# EasyEDA Pro project ProPrj_两相交错电源demo_2025-05-26.epro, schematic lm5143_1
Board Name: 5143一体板; Create Date: 2025-05-03; Page Name: P1; Project Name: 两相交错电源demo; Schematic Name: lm5143_1; Update Date: 2025-05-10; Company: 嘉立创EDA; Page Size: A4; Version: V1.0
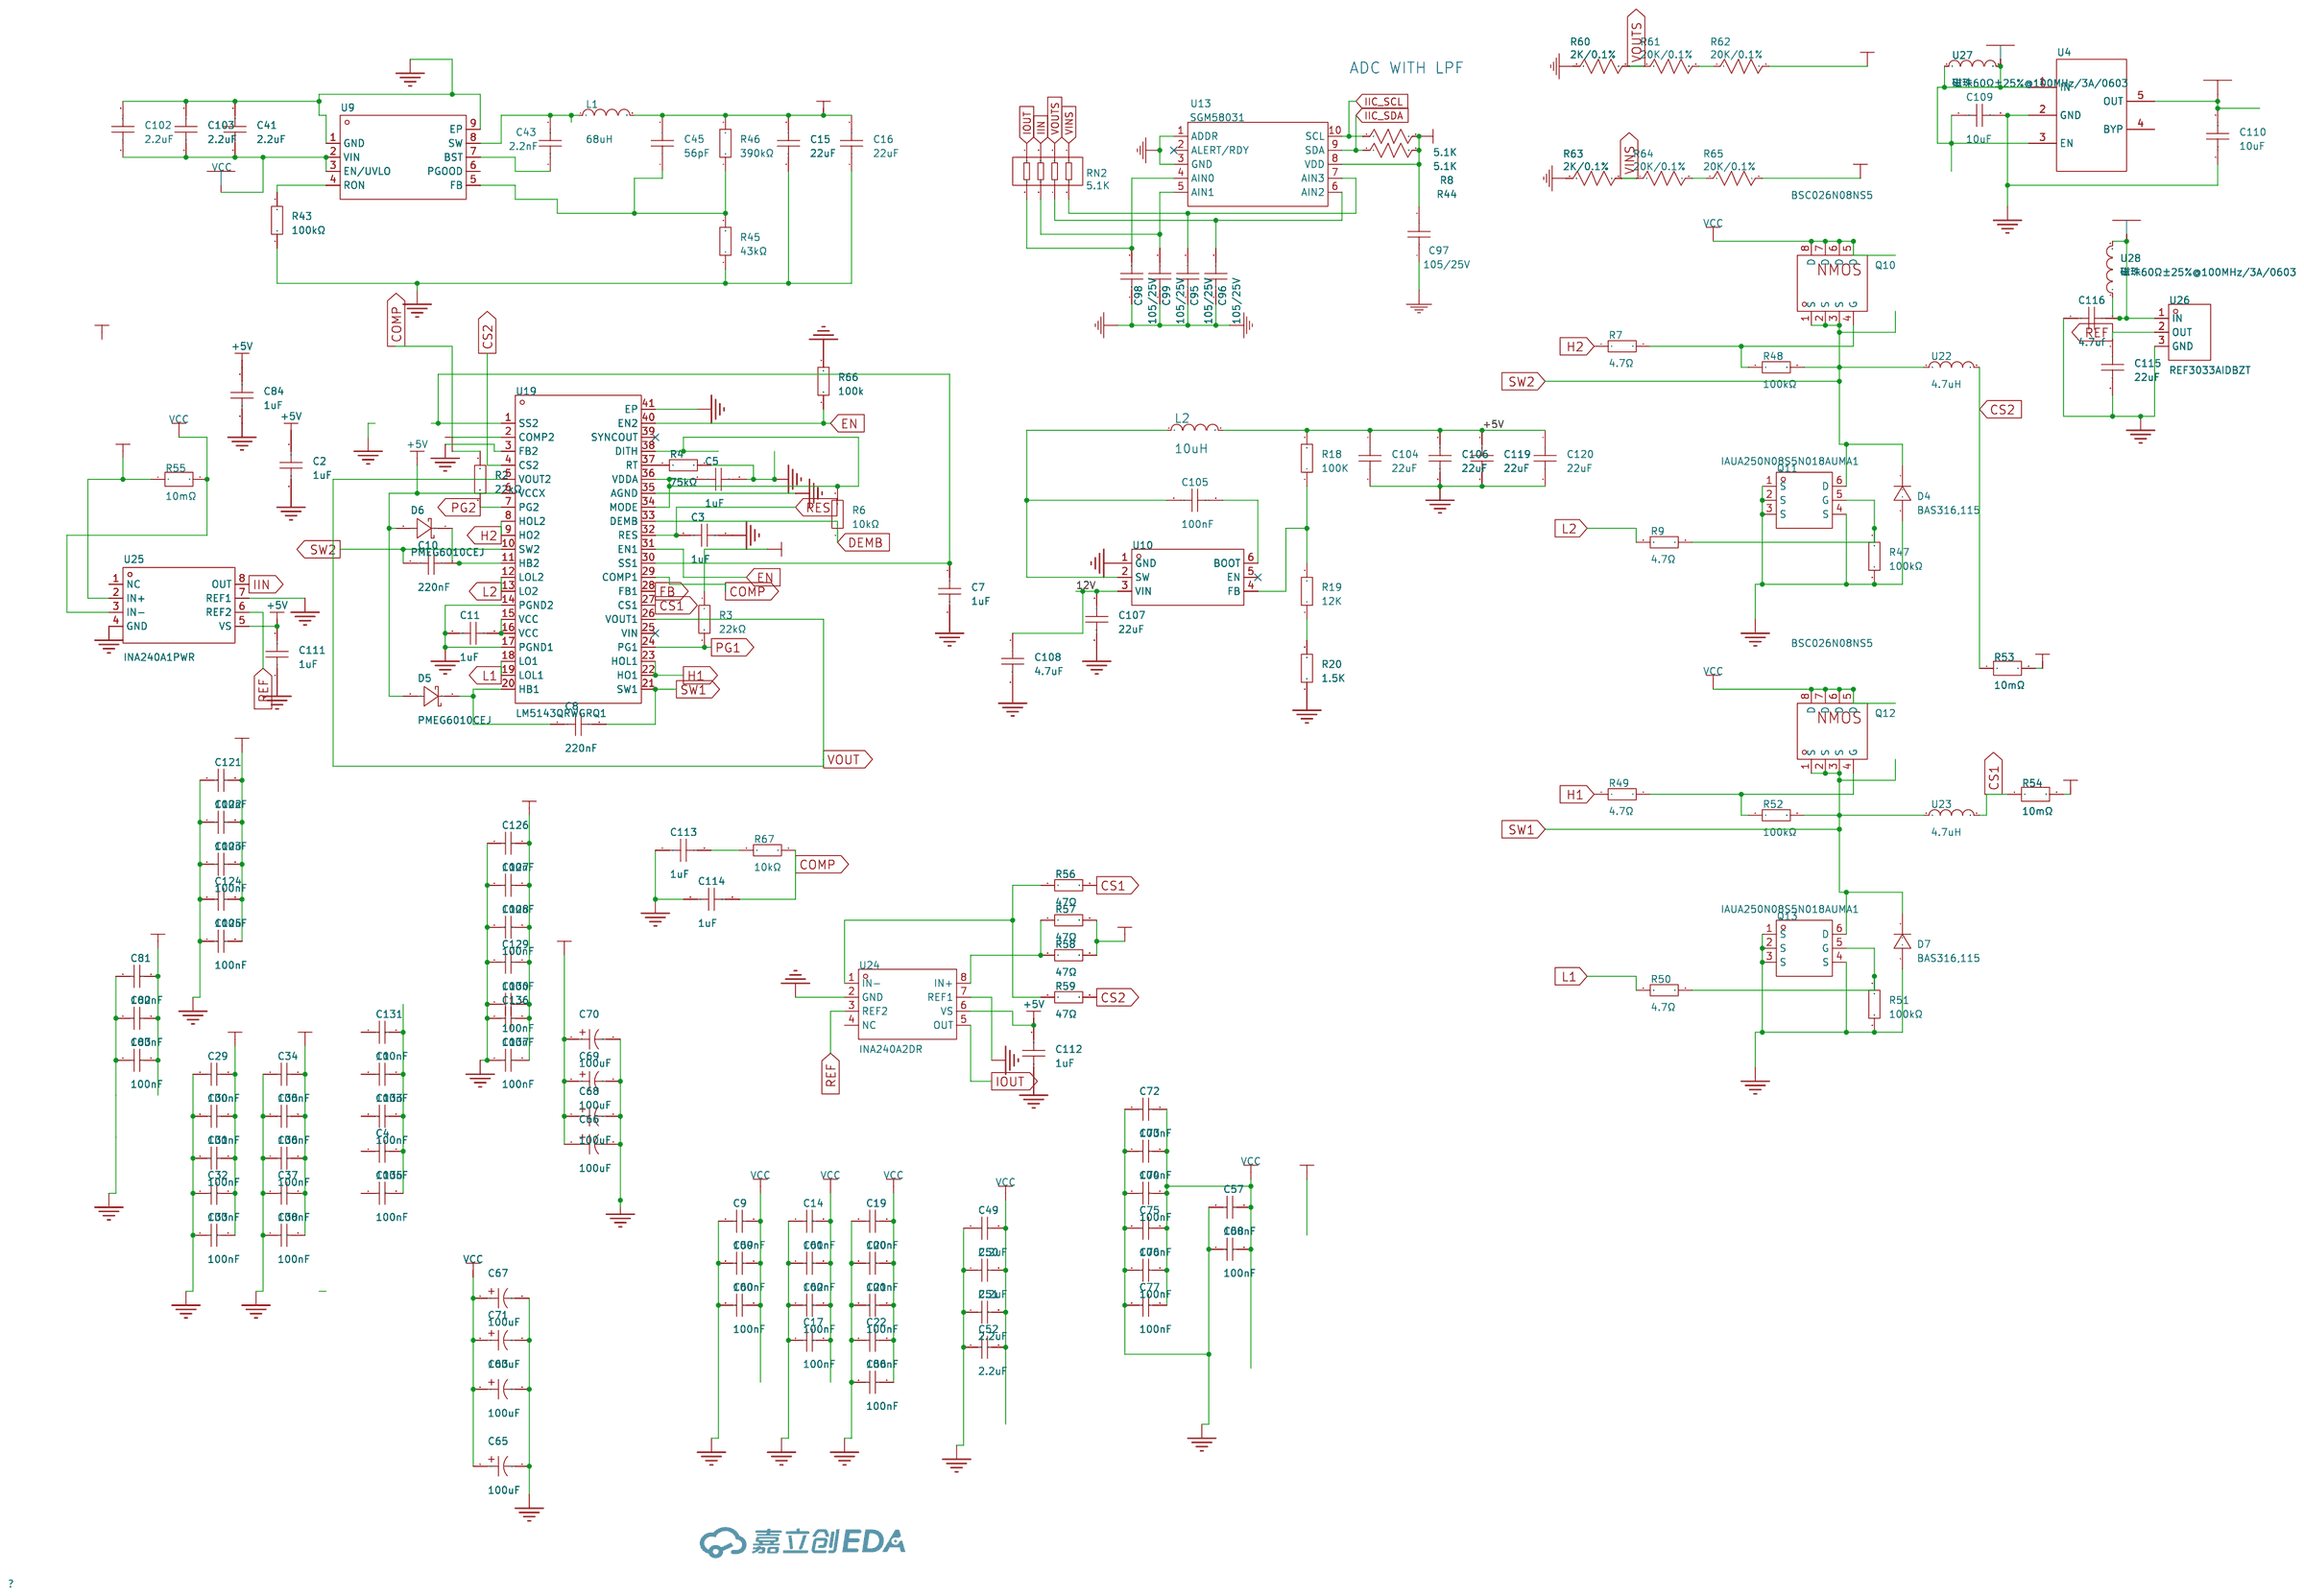
[diagram p1: schematic sheet]

## Parts
C1  100nF  [C1210]
C2  1uF  [C0603]
C3  1uF  [C0603]
C4  100nF  [C1210]
C5  1uF  [C0603]
C7  1uF  [C0603]
C8  220nF  [C0402]
C9  100nF  [C1210]
C10  220nF  [C0402]
C11  1uF  [C0603]
C14  100nF  [C1210]
C15  22uF  [C0805]
C16  22uF  [C0805]
C17  100nF  [C1206]
C19  100nF  [C1210]
C20  100nF  [C1210]
C21  100nF  [C1210]
C22  100nF  [C1210]
C29  100nF  [C1210]
C30  100nF  [C1210]
C31  100nF  [C1210]
C32  100nF  [C1210]
C33  100nF  [C1210]
C34  100nF  [C1210]
C35  100nF  [C1210]
C36  100nF  [C1210]
C37  100nF  [C1210]
C38  100nF  [C1210]
C41  2.2uF  [C0805]
C43  2.2nF  [C0603]
C45  56pF  [C0603]
C49  2.2uF  [C0805]
C50  2.2uF  [C0805]
C51  2.2uF  [C0805]
C52  2.2uF  [C0805]
C56  100nF  [C1210]
C57  100nF  [C1210]
C58  100nF  [C1210]
C59  100nF  [C1210]
C60  100nF  [C1210]
C61  100nF  [C1210]
C62  100nF  [C1206]
C63  100uF  [CAP-TH_BD10.0-P5.00-D0.6-FD_2]
C65  100uF  [CAP-TH_BD10.0-P5.00-D0.6-FD_2]
C66  100uF  [CAP-TH_BD10.0-P5.00-D0.6-FD_2]
C67  100uF  [CAP-TH_BD10.0-P5.00-D0.6-FD_2]
C68  100uF  [CAP-TH_BD10.0-P5.00-D0.6-FD_2]
C69  100uF  [CAP-TH_BD10.0-P5.00-D0.6-FD_2]
C70  100uF  [CAP-TH_BD10.0-P5.00-D0.6-FD_2]
C71  100uF  [CAP-TH_BD10.0-P5.00-D0.6-FD_2]
C72  100nF  [C1210]
C73  100nF  [C1210]
C74  100nF  [C1210]
C75  100nF  [C1210]
C76  100nF  [C1210]
C77  100nF  [C1210]
C81  100nF  [C1210]
C82  100nF  [C1210]
C83  100nF  [C1210]
C84  1uF  [C0603]
C95  105/25V  [C0603]
C96  105/25V  [C0603]
C97  105/25V  [C0603]
C98  105/25V  [C0603]
C99  105/25V  [C0603]
C102  2.2uF  [C0805]
C103  2.2uF  [C0805]
C104  22uF  [C0603]
C105  100nF  [C0603]
C106  22uF  [C0603]
C107  22uF  [C0805]
C108  4.7uF  [C0603]
C109  10uF  [C0603]
C110  10uF  [C0603]
C111  1uF  [C0603]
C112  1uF  [C0603]
C113  1uF  [C0603]
C114  1uF  [C0603]
C115  22uF  [C0603]
C116  4.7uf  [C0603]
C119  22uF  [C0603]
C120  22uF  [C0603]
C121  100nF  [C1210]
C122  100nF  [C1210]
C123  100nF  [C1210]
C124  100nF  [C1210]
C125  100nF  [C1210]
C126  100nF  [C1210]
C127  100nF  [C1210]
C128  100nF  [C1210]
C129  100nF  [C1210]
C130  100nF  [C1210]
C131  100nF  [C1210]
C133  100nF  [C1210]
C135  100nF  [C1210]
C136  100nF  [C1210]
C137  100nF  [C1210]
D4  BAS316,115  [SOD-323_L1.8-W1.3-LS2.5-FD]
D5  PMEG6010CEJ  [SOD-323_L1.7-W1.3-LS2.5-RD-1]
D6  PMEG6010CEJ  [SOD-323_L1.7-W1.3-LS2.5-RD-1]
D7  BAS316,115  [SOD-323_L1.8-W1.3-LS2.5-FD]
L1  68uH  [IND-SMD_L7.1-W6.6-1]
L2  10uH  [IND-SMD_L5.4-W5.2_FXL0530]
Q10  BSC026N08NS5  [PG-TDSON-8_L5.0-W6.0-P1.27-BL-EP]
Q11  IAUA250N08S5N018AUMA1  [PG-HSOF-5_L6.9-W6.7-P1.30-LS8.0-BL]
Q12  BSC026N08NS5  [PG-TDSON-8_L5.0-W6.0-P1.27-BL-EP]
Q13  IAUA250N08S5N018AUMA1  [PG-HSOF-5_L6.9-W6.7-P1.30-LS8.0-BL]
R2  22kΩ  [R0603]
R3  22kΩ  [R0603]
R4  75kΩ  [R0603]
R6  10kΩ  [R0603]
R7  4.7Ω  [R0603]
R8  5.1K  [R0603]
R9  4.7Ω  [R0603]
R18  100K  [R0603]
R19  12K  [R0603]
R20  1.5K  [R0603]
R43  100kΩ  [R0603]
R44  5.1K  [R0603]
R45  43kΩ  [R0603]
R46  390kΩ  [R0603]
R47  100kΩ  [R0603]
R48  100kΩ  [R0603]
R49  4.7Ω  [R0603]
R50  4.7Ω  [R0603]
R51  100kΩ  [R0603]
R52  100kΩ  [R0603]
R53  10mΩ  [RES-SMD_L6.4-W3.2-R2512]
R54  10mΩ  [RES-SMD_L6.4-W3.2-R2512]
R55  10mΩ  [RES-SMD_L6.4-W3.2-R2512]
R56  47Ω  [R0603]
R57  47Ω  [R0603]
R58  47Ω  [R0603]
R59  47Ω  [R0603]
R60  2K/0.1%  [R0603]
R61  20K/0.1%  [R0603]
R62  20K/0.1%  [R0603]
R63  2K/0.1%  [R0603]
R64  20K/0.1%  [R0603]
R65  20K/0.1%  [R0603]
R66  100k  [R0603]
R67  10kΩ  [R0603]
RN2  5.1K  [RES-ARRAY-SMD_0603-8P-L3.2-W1.6-BL]
U4  -  [SOT-23-5_L3.0-W1.7-P0.95-LS2.8-TL]
U9  -  [SO-8_L4.9-W3.9-P1.27-LS6.0-BL-EP]
U10  TPS54302DDCR  [SOT-23-6_L2.9-W1.6-P0.95-LS2.8-BL]
U13  SGM58031  [MSOP-10_L3.0-W3.0-P0.50-LS5.0-BR]
U19  LM5143QRWGRQ1  [VQFN-40_L6.0-W6.0-P0.50-TL-EP3.3]
U22  4.7uH  [IND-SMD_L23.5-W22.0]
U23  4.7uH  [IND-SMD_L23.5-W22.0]
U24  INA240A2DR  [SOIC-8_L4.9-W3.9-P1.27-LS6.0-BL]
U25  INA240A1PWR  [TSSOP-8_L4.4-W3.0-P0.65-LS6.4-BL]
U26  REF3033AIDBZT  [SOT-23-3_L2.9-W1.3-P1.90-LS2.4-BR]
U27  磁珠60Ω±25%@100MHz/3A/0603  [L0603]
U28  磁珠60Ω±25%@100MHz/3A/0603  [L0603]

## Library data of the parts
C1 C4 C9 C14 C17 C19-C22 C29-C38 C56-C62 C72-C77 C81-C83 C121-C131 C133 C135-C137 = CL31B104KBCNNNC: 容值:100nF;精度:±10%;额定电压:50V;材质(温度系数):X7R;; LCSC Part Name: 100nF ±10% 50V; Supplier Part: C24497; Manufacturer: SAMSUNG(三星); Supplier Footprint: 1206; JLCPCB Part Class: 基础库; Datasheet: https://atta.szlcsc.com/upload/public/pdf/source/20160218/1457707763339.pdf; Supplier: LCSC; Tolerance: ±10%; Voltage Rated: 50V; Temperature Coefficient: X7R
C2 C3 C5 C7 C11 C84 C111-C114 = CL10A105KB8NNNC: 容值:1uF;精度:±10%;额定电压:50V;材质(温度系数):X5R;; LCSC Part Name: 1uF ±10% 50V; Supplier Part: C15849; Manufacturer: SAMSUNG(三星); Supplier Footprint: 0603; JLCPCB Part Class: 基础库; Datasheet: https://atta.szlcsc.com/upload/public/pdf/source/20160218/1457707763339.pdf; Supplier: LCSC; Tolerance: ±10%; Voltage Rated: 50V; Temperature Coefficient: X5R
C8 C10 = CL10B224KA8NNNC: 容值:220nF;精度:±10%;额定电压:25V;材质(温度系数):X7R;; LCSC Part Name: 220nF ±10% 25V; Supplier Part: C21120; Manufacturer: SAMSUNG(三星); Supplier Footprint: 0603; JLCPCB Part Class: Basic Part; Datasheet: https://atta.szlcsc.com/upload/public/pdf/source/20160218/1457707763339.pdf; Supplier: LCSC; Tolerance: ±10%; Voltage Rated: 25V; Temperature Coefficient: X7R
C15 C16 = CL21A226MAQNNNE_C45783: 容值:22uF;精度:±20%;额定电压:25V;材质(温度系数):X5R;; LCSC Part Name: 22uF ±20% 25V; Supplier Part: C45783; Manufacturer: SAMSUNG(三星); Manufacturer Part: CL21A226MAQNNNE; Supplier Footprint: 0805; JLCPCB Part Class: 基础库; Datasheet: https://atta.szlcsc.com/upload/public/pdf/source/20160103/1457707727161.pdf; Supplier: LCSC; Tolerance: ±20%; Voltage Rated: 25V; Temperature Coefficient: X5R
C41 C102 C103 = HHV0805R7225K101NSLJ: 容值:2.2uF;精度:±10%;额定电压:100V;材质(温度系数):X7R;; LCSC Part Name: 2.2uF ±10% 100V; Supplier Part: C22367838; Manufacturer: Chinocera(华瓷); Supplier Footprint: 0805; JLCPCB Part Class: Extended Part; Datasheet: https://atta.szlcsc.com/upload/public/pdf/source/20240326/047A46E16B3E574E3E72A3B6624FA886.pdf; Supplier: LCSC; Tolerance: ±10%; Voltage Rated: 100V; Temperature Coefficient: X7R
C43 = C0603X5R106M160NT: 容值:10uF;精度:±20%;额定电压:16V;温度系数:X5R;; LCSC Part Name: 10uF ±20% 16V; Supplier Part: C466781; Manufacturer: SANYEAR(叁叶源); Supplier Footprint: 0603; Datasheet: https://atta.szlcsc.com/upload/public/pdf/source/20191209/C466781_7B1C97983691E173DFF63AE7A9C35A8A.pdf; Supplier: LCSC; Tolerance: ±20%; Voltage Rated: 16V; Temperature Coefficient: X5R
C45 = 0603N560J500CT: 容值:56pF;精度:±5%;额定电压:50V;材质(温度系数):NP0;; LCSC Part Name: 56pF ±5% 50V; Supplier Part: C302071; Manufacturer: Walsin(华新科); Supplier Footprint: 0603; JLCPCB Part Class: Extended Part; Datasheet: https://atta.szlcsc.com/upload/public/pdf/source/20191217/C469650_84AD5C6F618CF4AC0C6D987F2E8FE6F8.pdf; Supplier: LCSC; Tolerance: ±5%; Voltage Rated: 50V; Temperature Coefficient: NP0
C49-C52 = CGA0805X7R225K101MT: 容值:2.2uF;精度:±10%;额定电压:100V;材质(温度系数):X7R;; LCSC Part Name: 2.2uF ±10% 100V; Supplier Part: C6119935; Manufacturer: HRE(芯声); Supplier Footprint: 0805; JLCPCB Part Class: Extended Part; Datasheet: https://atta.szlcsc.com/upload/public/pdf/source/20240429/FFBBB2C1A6FCA7F2201C7203CC19BC42.pdf; Supplier: LCSC; Tolerance: ±10%; Voltage Rated: 100V; Temperature Coefficient: X7R
C63 C65-C71 = 1011001013R00: 容值:100uF;精度:±20%;额定电压:100V;; LCSC Part Name: 100uF ±20% 100V; Supplier Part: C2887236; Manufacturer: NJCON(永立); Supplier Footprint: 插件,D10xL12mm; JLCPCB Part Class: 扩展库; Datasheet: https://atta.szlcsc.com/upload/public/pdf/source/20210902/84CE7E45D44660992A8A41ADB32108B0.pdf; Supplier: LCSC; Tolerance: ±20%; Rated Voltage: 100V; φD: 10mm; L: 13mm; Operating Temperature: -55℃~+105℃
C95-C99 = 105/25V: Supplier: LCSC
C104 C106 C115 C116 C119 C120 = CL10A226MQ8NRNC: 容值:22uF;精度:±20%;额定电压:6.3V;材质(温度系数):X5R;; LCSC Part Name: 22uF ±20% 6.3V; Supplier Part: C59461; Manufacturer: SAMSUNG(三星); Supplier Footprint: 0603; JLCPCB Part Class: 基础库; Datasheet: https://atta.szlcsc.com/upload/public/pdf/source/20160103/1457707740762.pdf; Supplier: LCSC; Tolerance: ±20%; Voltage Rated: 6.3V; Temperature Coefficient: X5R
C105 = CAP_0402: Supplier Footprint: 0402
C107 = CL21A226MOQNNNE: 容值:22uF;精度:±20%;额定电压:16V;材质(温度系数):X5R;; LCSC Part Name: 22uF ±20% 16V; Supplier Part: C98190; Manufacturer: SAMSUNG(三星); Supplier Footprint: 0805; JLCPCB Part Class: Extended Part; Datasheet: https://atta.szlcsc.com/upload/public/pdf/source/20160218/1457707763339.pdf; Supplier: LCSC; Tolerance: ±20%; Voltage Rated: 16V; Temperature Coefficient: X5R
C108 = CGA0603X5R475K160JT: 容值:4.7uF;精度:±10%;额定电压:16V;材质(温度系数):X5R;; LCSC Part Name: 4.7uF ±10% 16V; Supplier Part: C6119855; Manufacturer: HRE(芯声); Supplier Footprint: 0603; JLCPCB Part Class: Extended Part; Supplier: LCSC; Tolerance: ±10%; Voltage Rated: 16V; Temperature Coefficient: X5R
C109 C110 = C0805S102K1RAC7800: 容值:1nF;精度:±10%;额定电压:100V;温度系数:X7R;; LCSC Part Name: 1nF ±10% 100V; Supplier Part: C141167; Manufacturer: KEMET(基美); Supplier Footprint: 0805; Datasheet: https://atta.szlcsc.com/upload/public/pdf/source/20171201/C141167_15121177000921156234.pdf; Supplier: LCSC; Tolerance: ±10%; Voltage Rated: 100V; Temperature Coefficient: X7R
D4 D7 = BAS316,115_C109218: 二极管配置:2个独立式;功率:400mW;直流反向耐压(Vr):100V;平均整流电流(Io):250mA;正向压降(Vf):1.25V@150mA;反向电流(Ir):500nA@80V;反向恢复时间(trr):4ns;工作温度:+150℃@(Tj);; LCSC Part Name: 100V 250mA 4ns; Supplier Part: C109218; Manufacturer: Nexperia(安世); Supplier Footprint: SOD-323; JLCPCB Part Class: Extended Part; Datasheet: https://atta.szlcsc.com/upload/public/pdf/source/20180720/C109218_B61203C01302E59E123412E2611A2044.pdf; Supplier: LCSC; Diode Configuration: 2个独立式; Power Dissipation: 400mW; Reverse Voltage (Vr): 100V; Average Rectified Current (Io): 250mA; Forward Voltage (Vf@If): 1.25V@150mA; Reverse Leakage Current: 500nA@80V; Reverse Recovery Time (trr): 4ns; Operating Temperature: +150℃@(Tj)
D5 D6 = PMEG6010CEJ: Supplier Part: C27636122; Manufacturer: DOWO(东沃); Supplier Footprint: SOD-323; JLCPCB Part Class: 扩展库; Datasheet: https://atta.szlcsc.com/upload/public/pdf/source/20240708/59BFFF43CC407FDF9ABD688CB819A6EB.pdf; Supplier: LCSC
L1 = PSPMAA0605H-680M-IGF: 电感值:68uH;精度:±20%;额定电流:2A;饱和电流(Isat):2.5A;; LCSC Part Name: 68uH ±20% 2.5A; Supplier Part: C2983094; Manufacturer: PROD(谱罗德); Supplier Footprint: SMD,6.6x7.1mm; JLCPCB Part Class: 扩展库; Datasheet: https://atta.szlcsc.com/upload/public/pdf/source/20220421/FA7B36985F5EDDBED7850D2E38F6BF27.pdf; Supplier: LCSC; Tolerance: ±20%; Rated Current: 2A; Saturation Current (Isat): 2.5A; DC Resistance (DCR): 256mΩ; Ratings: AEC-Q200
L2 = FXL0530-100-M: 电感值:10uH;精度:±20%;额定电流:3.2A;饱和电流(Isat):3.5A;; LCSC Part Name: 10uH ±20% 3.2A 110mΩ; Supplier Part: C177248; Manufacturer: cjiang(长江微电); Supplier Footprint: SMD,5.4x5.2x2.8mm; JLCPCB Part Class: 扩展库; Supplier: LCSC; Tolerance: ±20%; Rated Current: 3.2A; Saturation Current (Isat): 3.5A; DC Resistance (DCR): 110mΩ
Q10 Q12 = BSC026N08NS5: 类型:-;漏源电压(Vdss):-;连续漏极电流(Id):-;功率(Pd):-;导通电阻(RDS(on)@Vgs,Id):-;阈值电压(Vgs(th)@Id):-;; Supplier Part: C534311; Manufacturer: Infineon(英飞凌); Supplier Footprint: TDSON-8-EP(5x6); JLCPCB Part Class: 扩展库; Datasheet: https://atta.szlcsc.com/upload/public/pdf/source/20210128/C534311_A26F5C2A3F6ED0B8CFCE9EC3167D41E6.pdf; Supplier: LCSC
Q11 Q13 = IAUA250N08S5N018AUMA1: 类型:1个N沟道;漏源电压(Vdss):80V;连续漏极电流(Id):250A;导通电阻(RDS(on)@Vgs,Id):1.8mΩ@10V,100A;功率(Pd):238W;阈值电压(Vgs(th)@Id):3V@150uA;; LCSC Part Name: 1个N沟道 耐压:80V 电流:250A; Supplier Part: C3278535; Manufacturer: Infineon(英飞凌); Supplier Footprint: HSOF-5; JLCPCB Part Class: 扩展库; Datasheet: https://atta.szlcsc.com/upload/public/pdf/source/20240403/39AEE34ACE6EFA979F114E79687E3BC9.pdf; Supplier: LCSC; Type: 1个N沟道; Drain Source Voltage (Vdss): 80V; Continuous Drain Current (Id): 250A; Drain Source On Resistance (RDS(on)@Vgs,Id): 1.8mΩ@10V,100A; Power Dissipation (Pd): 238W; Gate Threshold Voltage (Vgs(th)@Id): 3V@150uA; Total Gate Charge (Qg@Vgs): 125nC@10V; Input Capacitance (Ciss@Vds): 8.715nF@40V; Reverse Transfer Capacitance (Crss@Vds): 70pF@40V; Operating Temperature: -55℃~+175℃
R2-R4 R6 R47 R48 R51 R52 R66 R67 = 0603WAF7502T5E: 电阻类型:厚膜电阻;阻值:75kΩ;精度:±1%;功率:100mW;最大工作电压:75V;温度系数:±100ppm/℃;; LCSC Part Name: 75kΩ ±1% 100mW 厚膜电阻; Supplier Part: C23242; Manufacturer: UNI-ROYAL(厚声); Supplier Footprint: 0603; JLCPCB Part Class: 基础库; Datasheet: https://atta.szlcsc.com/upload/public/pdf/source/20200306/C422600_1E6D84923E4A46A82E41ADD87F860B5C.pdf; Supplier: LCSC; Type: 厚膜电阻; Tolerance: ±1%; Power(Watts): 100mW; Overload Voltage (Max): 75V; Temperature Coefficient: ±100ppm/℃; Operating Temperature Range: -55℃~+155℃
R7 R9 R49 R50 = 0805W8F470KT5E: 电阻类型:厚膜电阻;阻值:4.7Ω;精度:±1%;功率:125mW;最大工作电压:150V;温度系数:±200ppm/℃;; LCSC Part Name: 4.7Ω ±1% 125mW 厚膜电阻; Supplier Part: C17675; Manufacturer: UNI-ROYAL(厚声); Supplier Footprint: 0805; JLCPCB Part Class: 基础库; Datasheet: https://atta.szlcsc.com/upload/public/pdf/source/20200306/C422600_1E6D84923E4A46A82E41ADD87F860B5C.pdf; Supplier: LCSC; Type: 厚膜电阻; Tolerance: ±1%; Power(Watts): 125mW; Overload Voltage (Max): 150V; Temperature Coefficient: ±200ppm/℃; Operating Temperature Range: -55℃~+155℃
R8 R44 RN2 = 5.1K: Supplier: LCSC
R18-R20 = Res_0402: Supplier Footprint: 0402
R43 = 0603WAF1603T5E: 电阻类型:厚膜电阻;阻值:160kΩ;精度:±1%;功率:1/10W;温度系数:±100ppm/;最大工作电压:75V;工作温度范围:-55~+155;; LCSC Part Name: 160kΩ ±1%; Supplier Part: C22813; Manufacturer: UNI-ROYAL(厚声); Supplier Footprint: 0603; Datasheet: https://atta.szlcsc.com/upload/public/pdf/source/20200306/C422600_1E6D84923E4A46A82E41ADD87F860B5C.pdf; Supplier: LCSC; Type: 厚膜电阻; Tolerance: ±1%; Power(Watts): 1/10W; Temperature Coefficient: ±100ppm/; Overload Voltage (Max): 75V; Operating Temperature Range: -55~+155
R45 = CR0603F43K0P05Z: 电阻类型:厚膜电阻;阻值:43kΩ;精度:±1%;功率:100mW;温度系数:±100ppm/℃;; LCSC Part Name: 厚膜电阻 43kΩ ±1% 100mW; Supplier Part: C881064; Manufacturer: EVER OHMS(天二科技); Supplier Footprint: 0603; JLCPCB Part Class: Extended Part; Datasheet: https://atta.szlcsc.com/upload/public/pdf/source/20201014/C881429_ABC29D63C8D6A11EB63D87348B25AA7B.pdf; Supplier: LCSC; Type: 厚膜电阻; Tolerance: ±1%; Power(Watts): 100mW; Temperature Coefficient: ±100ppm/℃; Operating Temperature Range: -55℃~+155℃
R46 = RS-03K3903FT: 电阻类型:厚膜电阻;阻值:390kΩ;精度:±1%;功率:100mW;最大工作电压:50V;温度系数:±100ppm/℃;; LCSC Part Name: 厚膜电阻 390kΩ ±1% 100mW; Supplier Part: C310278; Manufacturer: FH(风华); Supplier Footprint: 0603; JLCPCB Part Class: Extended Part; Datasheet: https://atta.szlcsc.com/upload/public/pdf/source/20140616/1457707091974.pdf; Supplier: LCSC; Type: 厚膜电阻; Tolerance: ±1%; Power(Watts): 100mW; Overload Voltage (Max): 50V; Temperature Coefficient: ±100ppm/℃; Operating Temperature Range: -55℃~+155℃
R53-R55 = HoJLR2512-3W-10mR-1%: 电阻类型:采样电阻;阻值:10mΩ;精度:±1%;功率:3W;安装方式:贴片;; LCSC Part Name: 10mΩ ±1% 3W; Supplier Part: C2903468; Manufacturer: Milliohm(毫欧); Supplier Footprint: 2512; JLCPCB Part Class: 扩展库; Datasheet: https://atta.szlcsc.com/upload/public/pdf/source/20211009/7525CABAB363C979E942C1DD41F1FEF0.pdf; Supplier: LCSC; Type: 采样电阻; Tolerance: ±1%; Power(Watts): 3W; Mounting Sytle: 贴片
R56-R59 = 0603WAF470JT5E: 电阻类型:厚膜电阻;阻值:47Ω;精度:±1%;功率:100mW;最大工作电压:75V;温度系数:±100ppm/℃;; LCSC Part Name: 47Ω ±1% 100mW 厚膜电阻; Supplier Part: C23182; Manufacturer: UNI-ROYAL(厚声); Supplier Footprint: 0603; JLCPCB Part Class: 基础库; Datasheet: https://atta.szlcsc.com/upload/public/pdf/source/20200306/C422600_1E6D84923E4A46A82E41ADD87F860B5C.pdf; Supplier: LCSC; Type: 厚膜电阻; Tolerance: ±1%; Power(Watts): 100mW; Overload Voltage (Max): 75V; Temperature Coefficient: ±100ppm/℃; Operating Temperature Range: -55℃~+155℃
R60 R63 = 2K/0.1%: Supplier: LCSC
R61 R62 R64 R65 = 20K/0.1%: Supplier: LCSC
U4 = SPX3819M5-L-5-0/TR: 输出类型:固定;输出极性:正;输出通道数:1;最大输入电压:16V;输出电压:5V;压差:700mV@(500mA);输出电流:500mA;电源纹波抑制比(PRSS):-;; LCSC Part Name: Vin=16V Vout=5V 500mA; Supplier Part: C13417; Manufacturer: MaxLinear; Supplier Footprint: SOT-23-5; Datasheet: https://atta.szlcsc.com/upload/public/pdf/source/20150720/1457707331934.pdf; Supplier: LCSC; Output Type: 固定; Output Polarity: 正; Number of Outputs: 1; Maximum Input Voltage: 16V; Output Voltage: 5V; Dropout Voltage: 700mV@(500mA); Output Current: 500mA
U9 = LM5164DDAR: 功能类型:降压型;同步整流:-;输出通道数:-;拓扑结构:-;输入电压:-;输出电流(最大值):-;开关频率:-;; LCSC Part Name: 降压型; Supplier Part: C477928; Manufacturer: TI(德州仪器); Supplier Footprint: SO-8; Datasheet: https://atta.szlcsc.com/upload/public/pdf/source/20200102/C477928_A6130A40DCA2C193067E68A47DE8CF0C.pdf; Supplier: LCSC; Function: 降压型
U10 = TPS54302DDCR: 功能类型:降压型;输出类型:可调;输入电压:4.5V~28V;输出电压:596mV~28V;输出电流(最大值):3A;; LCSC Part Name: 降压型 输入4.5V~28V 输出596mV~28V 3A; Supplier Part: C311983; Manufacturer: TI(德州仪器); Supplier Footprint: TSOT-23-6; JLCPCB Part Class: 扩展库; Datasheet: https://atta.szlcsc.com/upload/public/pdf/source/20181023/C311983_0948EE70BFAD2011B492BD3F4CEA709D.pdf; Supplier: LCSC; Function: 降压型; Synchronous Rectification: 是; Output Type: 可调; Number of Outputs: 1; Topology: 降压式; Input Voltage: 4.5V~28V; Output Voltage: 596mV~28V; Output Current (Max): 3A; Switching Frequency: 400kHz; Operating Temperature: -40℃~+125℃@(TJ)
U13 = SGM58031: Supplier: LCSC; image: //image.lceda.cn/szlcsc/C37593.jpg; JLCPCB Part Class: Extend; JLCPCB SMD: Yes
U19 = LM5143QRWGRQ1: 功能类型:降压型;工作电压:3.5V~65V;输出电流:-;; LCSC Part Name: 具有低IQ的汽车类3.5V至65V双路同步降压控制器; Supplier Part: C1849541; Manufacturer: TI(德州仪器); Supplier Footprint: VQFN-40-EP(6x6); JLCPCB Part Class: 扩展库; Datasheet: https://www.ti.com/cn/lit/gpn/lm5143-q1; Supplier: LCSC; Function: 降压型; Input Voltage: 3.5V~65V; Switching Frequency: 2.2MHz; Operating Temperature: -40℃~+150℃@(TJ); Synchronous Rectification: 是; Number of Outputs: 2; Topology: 降压式; Switch tube (built-in/external): 外置
U22 U23 = MWSA2213S-4R7MT: 电感值:4.7uH;精度:±20%;饱和电流(Isat):38A;类型:一体成型电感;; LCSC Part Name: 4.7uH ±20% 38A; Supplier Part: C19267563; Manufacturer: Sunlord(顺络); Supplier Footprint: SMD,23.5x22mm; Datasheet: https://atta.szlcsc.com/upload/public/pdf/source/20231031/6FCCCAEF5933DB5F1F057864C2C24599.pdf; Supplier: LCSC; Tolerance: ±20%; Saturation Current (Isat): 38A; DC Resistance (DCR): 2.2mΩ; Type: 一体成型电感
U24 = INA240A2DR: 放大器数:单路;; LCSC Part Name: 电流检测放大器指南; Supplier Part: C2060768; Manufacturer: TI(德州仪器); Supplier Footprint: SOIC-8; JLCPCB Part Class: 扩展库; Datasheet: https://www.ti.com/cn/lit/gpn/ina240; Supplier: LCSC; Number of Channels: 单路; Supply Current: 1.8mA; Operating Temperature: -40℃~+125℃
U25 = INA240A1PWR: 放大器数:单路;; Supplier Part: C93965; Manufacturer: TI(德州仪器); Supplier Footprint: TSSOP-8; JLCPCB Part Class: 扩展库; Datasheet: https://www.ti.com/cn/lit/gpn/ina240; Supplier: LCSC; Number of Channels: 单路; Supply Current: 1.8mA; Operating Temperature: -40℃~+125℃
U26 = REF3033AIDBZT: 输出类型:固定;输入电压:3.35V~5.5V;输出电压:3.3V;输出电流:25mA;精度:±0.2%;; Supplier Part: C2872391; Manufacturer: TI(德州仪器); Supplier Footprint: SOT-23-3; JLCPCB Part Class: 扩展库; Datasheet: https://www.ti.com/cn/lit/gpn/ref3012; Supplier: LCSC; Output Type: 固定; Input Voltage: 3.35V~5.5V; Output Voltage: 3.3V; Output Current: 25mA; Tolerance: ±0.2%; Temperature Coefficient: 75ppm/℃; Reference Type: 串联; Supply Current: 50uA; Noise - 10Hz to 10kHz: 105uVrms; Operating Temperature: -40℃~+125℃@(Ta)
U27 U28 = 磁珠60Ω±25%@100MHz/3A/0603: Supplier Part: C9900021622; Supplier Footprint: 0603; JLCPCB Part Class: 扩展库; Supplier: LCSC

## Nets
12V: C15.2 C16.2 C45.2 C107.1 C108.1 L1.2 R46.2 U10.3(VIN)
+3.3V: C97.2 C110.2 R2.1 R3.1 R8.2 R44.2 U4.5(OUT) U13.8(VDD)
+5V: C2.1 C84.1 C104.1 C106.1 C109.1 C111.2 C112.1 C116.2 C119.1 C120.1 D5.2(A) D6.2(A) L2.2 R18.2 U4.1(IN) U4.3(EN) U19.6(VCCX) U24.6(VS) U25.5(VS) U26.1(IN) U27.1 U27.2 U28.1 U28.2
GND: C2.2 C3.2 C5.2 C7.2 C9.1 C11.1 C14.1 C15.1 C16.1 C17.1 C19.1 C20.1 C21.1 C22.1 C29.1 C30.1 C31.1 C32.1 C33.1 C34.1 C35.1 C36.1 C37.1 C38.1 C41.2 C49.1 C50.1 C51.1 C52.1 C56.1 C57.1 C58.1 C59.1 C60.1 C61.1 C62.1 C63.2 C65.2 C66.2 C67.2 C68.2 C69.2 C70.2 C71.2 C72.1 C73.1 C74.1 C75.1 C76.1 C77.1 C81.1 C82.1 C83.1 C84.2 C95.1 C96.1 C97.1 C98.1 C99.1 C102.2 C103.2 C104.2 C106.2 C107.2 C108.2 C109.2 C110.1 C111.1 C112.2 C113.1 C114.1 C115.2 C116.1 C119.2 C120.2 C121.1 C122.1 C123.1 C124.1 C125.1 C126.1 C127.1 C128.1 C129.1 C130.1 C136.1 C137.1 D4.1(A) D7.1(A) Q11.1(S) Q11.2(S) Q11.3(S) Q11.4(S) Q13.1(S) Q13.2(S) Q13.3(S) Q13.4(S) R4.2 R20.1 R43.1 R45.1 R47.2 R51.2 R60.1 R63.1 R66.1 U4.2(GND) U9.1(GND) U9.9(EP) U10.1(GND) U13.1(ADDR) U13.3(GND) U19.3(FB2) U19.14(PGND2) U19.17(PGND1) U19.35(AGND) U19.41(EP) U24.2(GND) U24.7(REF1) U25.4(GND) U25.7(REF1) U26.3(GND)
VCC: C9.2 C14.2 C17.2 C19.2 C20.2 C21.2 C22.2 C41.1 C49.2 C50.2 C51.2 C52.2 C56.2 C57.2 C58.2 C59.2 C60.2 C61.2 C62.2 C63.1 C65.1 C67.1 C71.1 C72.2 C73.2 C74.2 C75.2 C76.2 C77.2 C102.1 C103.1 Q10.5(D) Q10.6(D) Q10.7(D) Q10.8(D) Q12.5(D) Q12.6(D) Q12.7(D) Q12.8(D) R55.2 R65.2 U9.2(VIN) U9.3(EN/UVLO) U25.3(IN-)
VIN: R55.1 U25.2(IN+)
VINS: R63.2 R64.1 RN2.1
COMP: C114.2 R67.1 U19.2(COMP2) U19.29(COMP1)
CS1: R54.1 R56.2 U19.27(CS1) U23.2
CS2: R53.1 R59.2 U19.4(CS2) U22.2
DEMB: R6.1 U19.33(DEMB)
EN: R66.2 U19.31(EN1) U19.40(EN2)
FB: U19.28(FB1)
H1: R49.1 U19.22(HO1) U19.23(HOL1)
H2: R7.1 U19.8(HOL2) U19.9(HO2)
IIC_SCL: R8.1 U13.10(SCL)
IIC_SDA: R44.1 U13.9(SDA)
IIN: RN2.3 U25.8(OUT)
IOUT: RN2.4 U24.5(OUT)
L1: R50.1 U19.18(LO1) U19.19(LOL1)
L2: R9.1 U19.12(LOL2) U19.13(LO2)
PG1: R3.2 U19.24(PG1)
PG2: R2.2 U19.7(PG2)
REF: C115.1 U24.3(REF2) U25.6(REF2) U26.2(OUT)
RES: C3.1 U19.32(RES)
SW1: C8.2 D7.2(K) Q12.1(S) Q12.2(S) Q12.3(S) Q13.6(D) R52.2 U19.21(SW1) U23.1
SW2: C10.1 D4.2(K) Q10.1(S) Q10.2(S) Q10.3(S) Q11.6(D) R48.2 U19.10(SW2) U22.1
VOUT: C1.2 C4.2 C29.2 C30.2 C31.2 C32.2 C33.2 C34.2 C35.2 C36.2 C37.2 C38.2 C66.1 C68.1 C69.1 C70.1 C81.2 C82.2 C83.2 C121.2 C122.2 C123.2 C124.2 C125.2 C126.2 C127.2 C128.2 C129.2 C130.2 C131.2 C133.2 C135.2 C136.2 C137.2 R53.2 R54.2 R57.2 R58.2 R62.2 U19.5(VOUT2) U19.26(VOUT1)
VOUTS: R60.2 R61.1 RN2.2
$1N920: C11.2 U19.15(VCC) U19.16(VCC)
$1N1636: C7.1 U19.1(SS2) U19.30(SS1)
$1N1751: R4.1 U19.37(RT)
$1N1787: C5.1 R6.2 U19.34(MODE) U19.36(VDDA) U19.38(DITH)
$1N4968: Q10.4(G) R7.2 R48.1
$1N4976: Q11.5(G) R9.2 R47.1
$1N5499: C8.1 D5.1(C) U19.20(HB1)
$1N5574: C10.2 D6.1(C) U19.11(HB2)
$1N7681: R43.2 U9.4(RON)
$1N7684: C43.2 L1.1 U9.8(SW)
$1N7685: C43.1 U9.7(BST)
$1N7687: C45.1 R45.2 R46.1 U9.5(FB)
$1N8268: Q12.4(G) R49.2 R52.1
$1N8274: Q13.5(G) R50.2 R51.1
$1N24788: R57.1 R58.1 U24.8(IN+)
$1N24792: R56.1 R59.1 U24.1(IN-)
$1N25603: C99.2 RN2.6 U13.5(AIN1)
$1N25604: C95.2 RN2.8 U13.7(AIN3)
$1N25605: C96.2 RN2.7 U13.6(AIN2)
$1N25606: C98.2 RN2.5 U13.4(AIN0)
$1N32854: C105.1 L2.1 U10.2(SW)
$1N32855: C105.2 U10.6(BOOT)
$1N32858: R19.1 R20.2
$1N32864: R18.1 R19.2 U10.4(FB)
$1N33061: R61.2 R62.1
$1N33196: R64.2 R65.1
$1N37380: C113.2 R67.2

Not connected (* = marked no-connect by the designer): C1 1; C4 1; C131 1; C133 1; C135 1; U4 4(BYP); U9 6(PGOOD); U10 5(EN)*; U13 2(ALERT/RDY)*; U19 25(VIN)* 39(SYNCOUT)*; U24 4(NC); U25 1(NC)

## Notes on the sheet
- ADC WITH LPF
